# Altium schematic sheet PIC32MX.SchDoc
size A
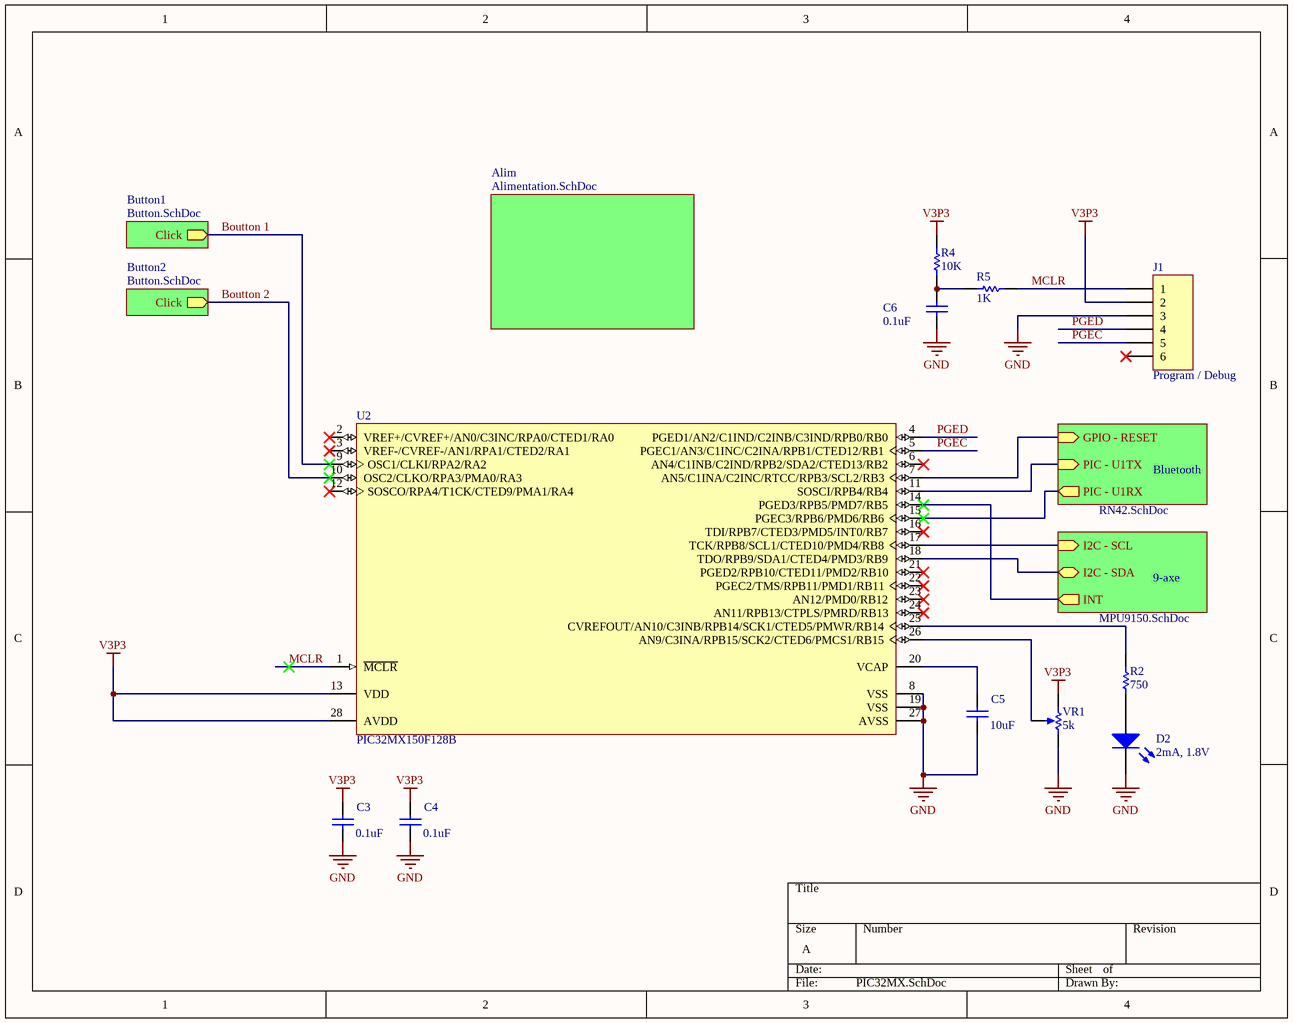
[diagram p0: PIC32MX.SchDoc]

## Parts
C3  0.1uF  [CAP 0603]
C4  0.1uF  [CAP 0603]
C5  10uF  [CAP 0603]
C6  0.1uF  [CAP 0603]
D2  2mA, 1.8V  [LED]
J1  Program / Debug  [ICSP]
R2  750  [RES 0603]
R4  10K  [RES 0603]
R5  1K  [RES 0603]
U2  PIC32MX150F128B  [PIC32MX150F128B]
VR1  5k  [91A1A-B28-B13L]

## Sub-sheets
9-axe = MPU9150.SchDoc: I2C - SCL (in), I2C - SDA (bidir), INT (out)
Alim = Alimentation.SchDoc: no entries
Bluetooth = RN42.SchDoc: GPIO - RESET (in), PIC - U1TX (in), PIC - U1RX (out)
Button1 = Button.SchDoc: Click (out)
Button2 = Button.SchDoc: Click (out)

## Nets
GND: C3.1 C4.1 C5.1 C6.1 D2.2(K) J1.3 U2.8(VSS) U2.19(VSS) U2.27(AVSS) VR1.2(BOT)
V3P3: C3.2 C4.2 J1.2 R4.2 U2.13(VDD) U2.28(AVDD) VR1.1(TOP)
Boutton 1: U2.9(OSC1/CLKI/RPA2/RA2) ; sheet Button1/Click
Boutton 2: U2.10(OSC2/CLKO/RPA3/PMA0/RA3) ; sheet Button2/Click
MCLR: J1.1 R5.1 U2.1(~{MCLR})
PGEC: J1.5 U2.5(PGEC1/AN3/C1INC/C2INA/RPB1/CTED12/RB1)
PGED: J1.4 U2.4(PGED1/AN2/C1IND/C2INB/C3IND/RPB0/RB0)
NetC5_2: C5.2 U2.20(VCAP)
NetC6_2: C6.2 R4.1 R5.2
NetD2_1: D2.1(A) R2.1
NetR2_2: R2.2 U2.25(CVREFOUT/AN10/C3INB/RPB14/SCK1/CTED5/PMWR/RB14)
NetU2_7: U2.7(AN5/C1INA/C2INC/RTCC/RPB3/SCL2/RB3) ; sheet Bluetooth/GPIO - RESET
NetU2_11: U2.11(SOSCI/RPB4/RB4) ; sheet Bluetooth/PIC - U1TX
NetU2_14: U2.14(PGED3/RPB5/PMD7/RB5) ; sheet 9-axe/INT
NetU2_15: U2.15(PGEC3/RPB6/PMD6/RB6) ; sheet Bluetooth/PIC - U1RX
NetU2_17: U2.17(TCK/RPB8/SCL1/CTED10/PMD4/RB8) ; sheet 9-axe/I2C - SCL
NetU2_18: U2.18(TDO/RPB9/SDA1/CTED4/PMD3/RB9) ; sheet 9-axe/I2C - SDA
NetU2_26: U2.26(AN9/C3INA/RPB15/SCK2/CTED6/PMCS1/RB15) VR1.3(TAP)

Not connected (* = marked no-connect by the designer): J1 6*; U2 2(VREF+/CVREF+/AN0/C3INC/RPA0/CTED1/RA0)* 3(VREF-/CVREF-/AN1/RPA1/CTED2/RA1)* 6(AN4/C1INB/C2IND/RPB2/SDA2/CTED13/RB2)* 12(SOSCO/RPA4/T1CK/CTED9/PMA1/RA4)* 16(TDI/RPB7/CTED3/PMD5/INT0/RB7)* 21(PGED2/RPB10/CTED11/PMD2/RB10)* 22(PGEC2/TMS/RPB11/PMD1/RB11)* 23(AN12/PMD0/RB12)* 24(AN11/RPB13/CTPLS/PMRD/RB13)*

## Library data of the parts
C3-C6 = Cap: Capacitor; PackageReference: RAD-0.3; PackageDescription: Radial Cap, Thru-Hole; 2 Leads; 0.3 in Pin Spacing
  C3 C4 C6: Value: 0.1uF
  C5: Value: 10uF
D2 = LED0: Typical INFRARED GaAs LED; Fabricant: Kingbright; Fournisseur: Farnell; RefFabricant: KPT-2012LVSECK-J3-PRV; RefFournisseur: 2610416; PackageReference: LED-0; PackageDescription: LED; 2 Leads; Value: 2mA, 1.8V
J1 = MHDR1X6: Header, 6-Pin; Fabricant: MOLEX; Fournisseur: Farnell; RefFournisseur: 9731172; PackageDescription: Debug Interface; RefFabricant: 22-27-2061
R2 R4 R5 = Res1: Resistor; PackageReference: AXIAL-0.3; PackageDescription: Axial Device, Thru-Hole; 2 Leads; 0.3 in Pin Spacing
  R2: Value: 750
  R4: Value: 10K
  R5: Value: 1K
U2 = PIC32MX130F256B: PIC32MX Family Microcontroller; Fournisseur: Farnell; Fabricant: Microchip; RefFabricant: PIC32MX150F128B-I/SO; RefFournisseur: 2313766; PackageDescription: Pic32; PackageReference: SOIC
VR1 = RPot: Potentiometer; Set Position: 0.5; Fabricant: Bourns; Fournisseur: Farnell; RefFournisseur: 9357750; PackageReference: VR5; PackageDescription: Variable Resistor, Thru-Hole; 3 Leads; Value: 5K; RefFabricant: 91A1A-B28-B13L